# EAGLE schematic Schematic (EAGLE 9.7.0)
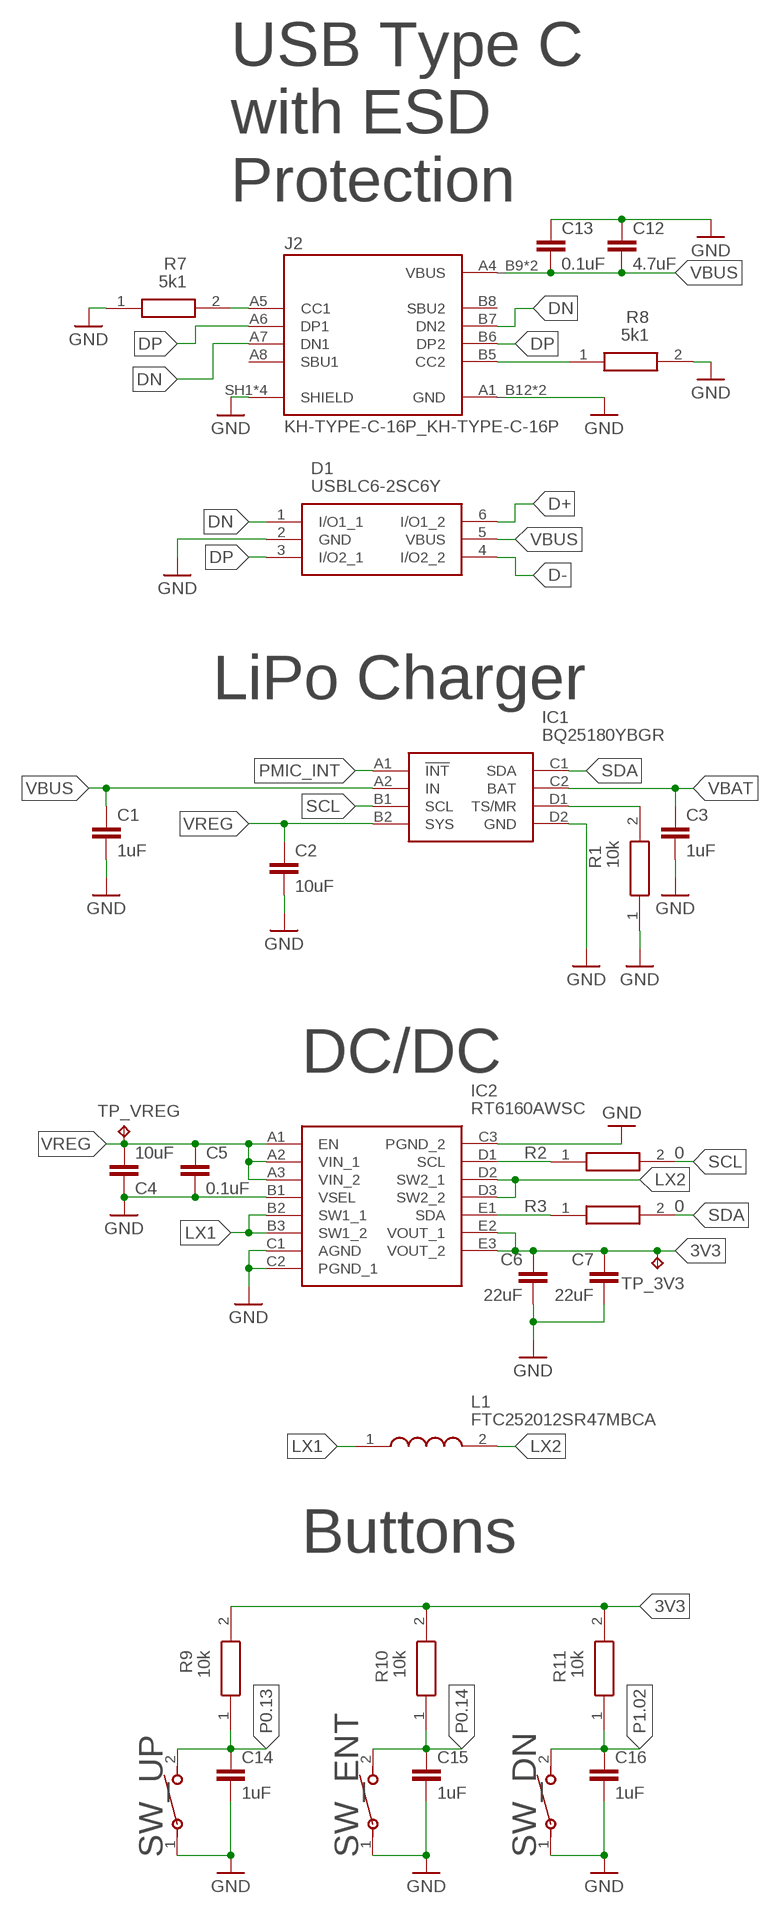
[diagram p0: schematic, sheet 1, part 1 of 2]
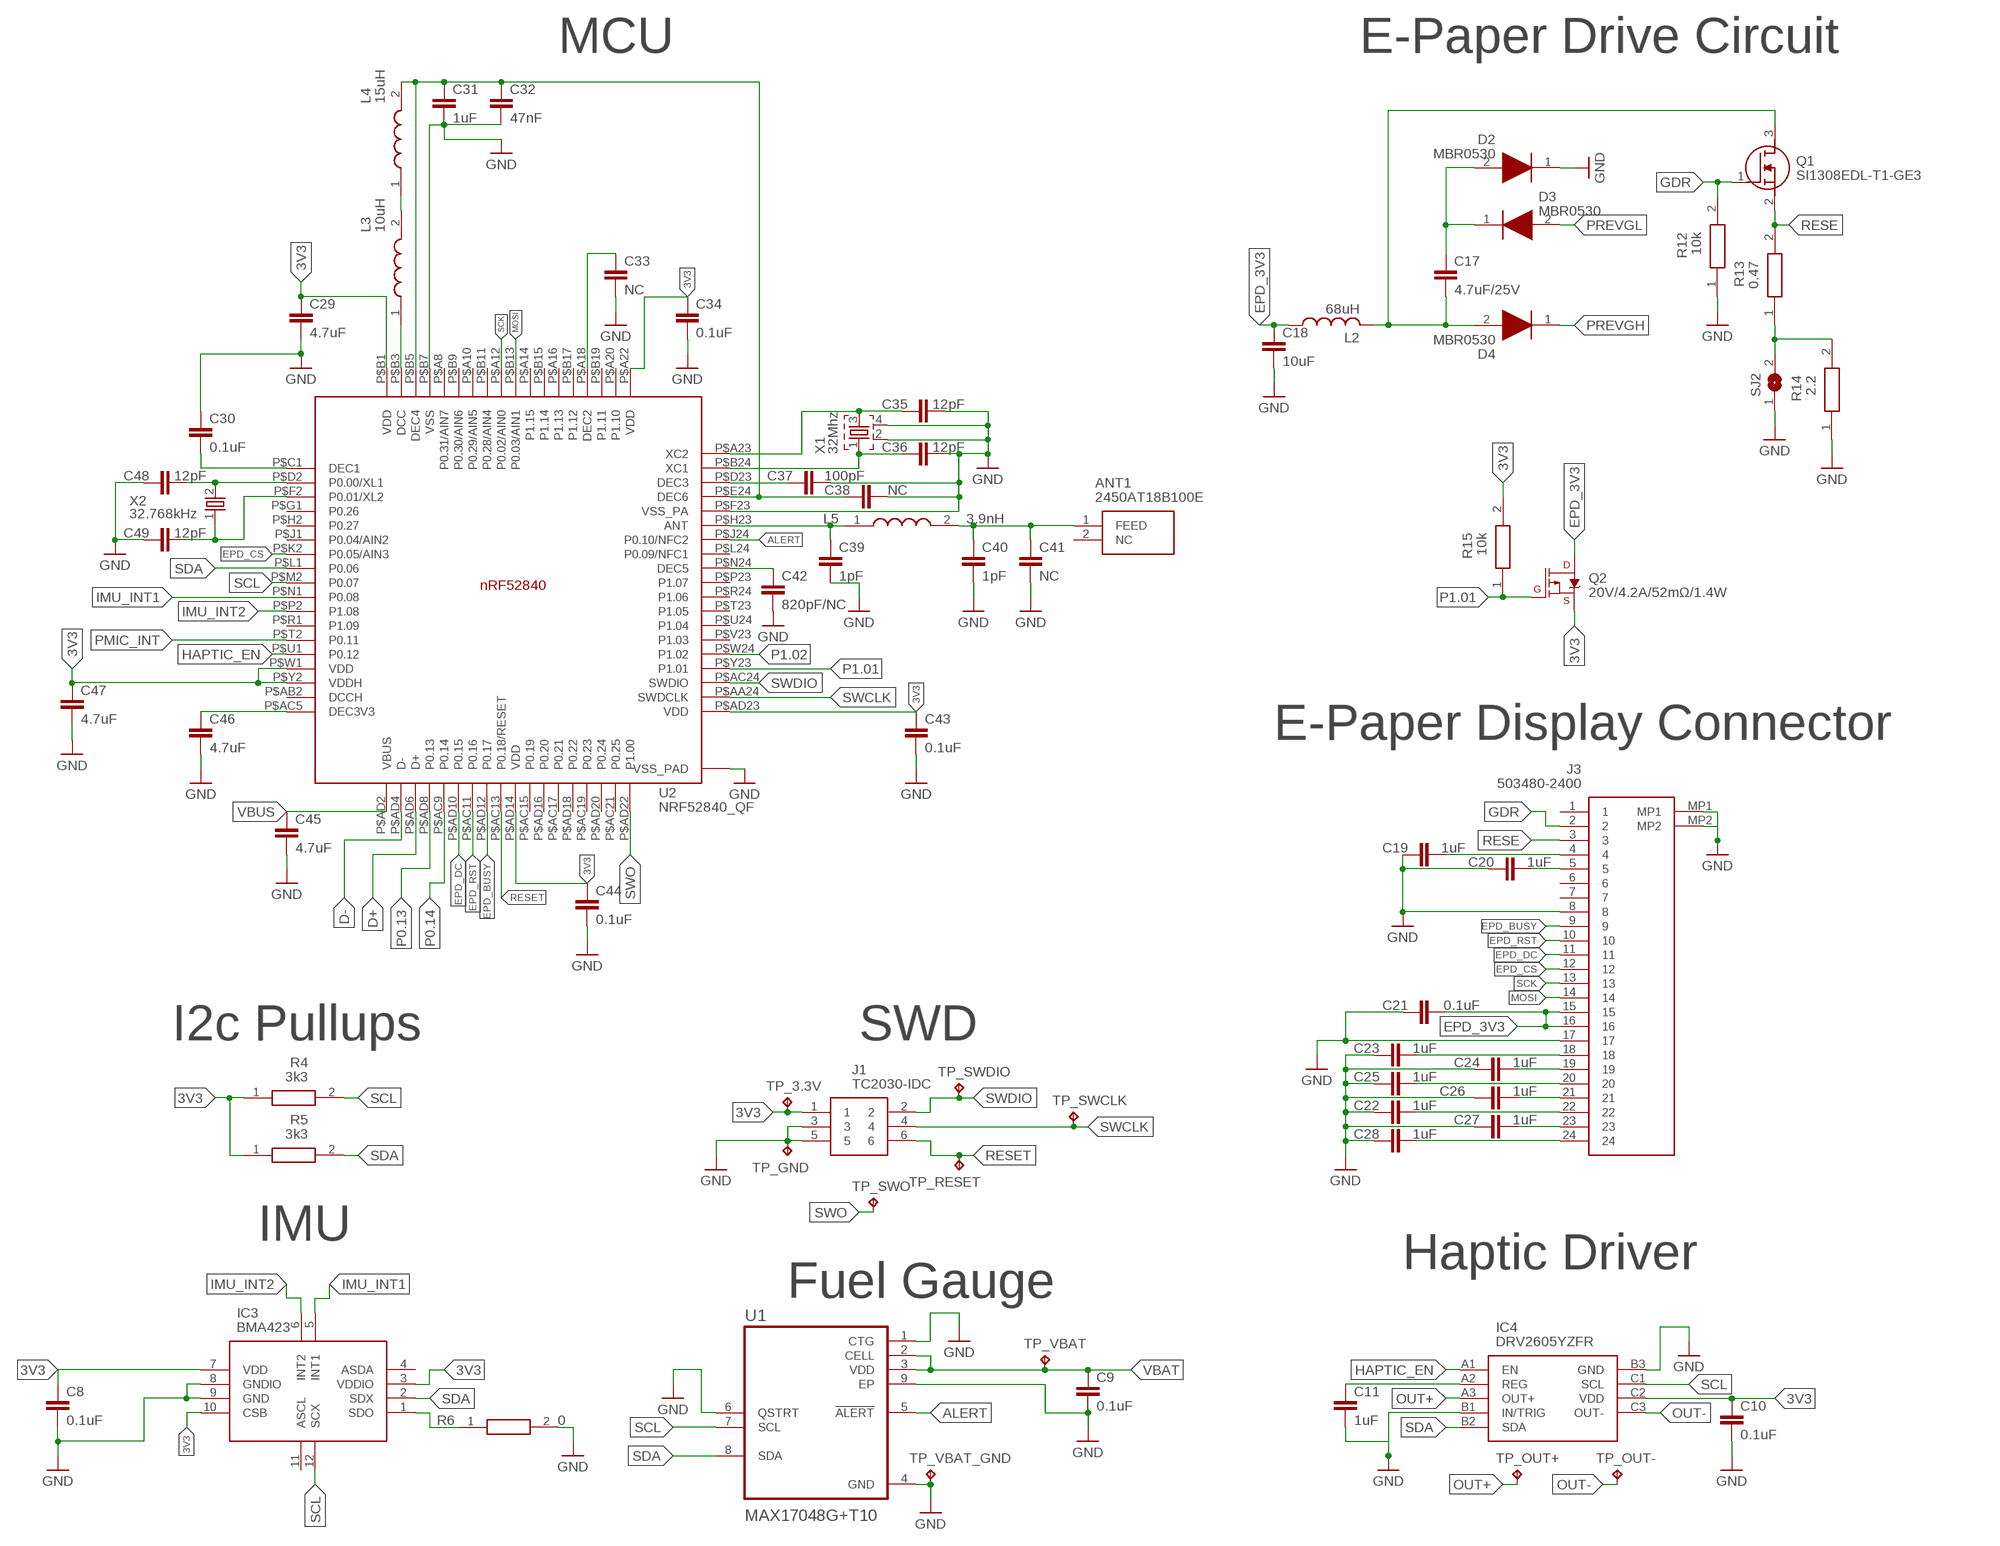
[diagram p1: schematic, sheet 1, part 2 of 2]

## Parts
ANT1  2450AT18B100E  2450AT18B100E_2450AT18B100E  [2450AT18B100E_ANTC3216X140N]
C1  1uF  NORDIC_NRF_3_CAPACITOR_0402_N  [NORDIC_NRF_3_RESC0402_N]
C2  10uF  NORDIC_NRF_3_CAPACITOR_0402_N  [NORDIC_NRF_3_RESC0402_N]
C3  1uF  NORDIC_NRF_3_CAPACITOR_0402_N  [NORDIC_NRF_3_RESC0402_N]
C4  10uF  NORDIC_NRF_3_CAPACITOR_0402_N  [NORDIC_NRF_3_RESC0402_N]
C5  0.1uF  NORDIC_NRF_3_CAPACITOR_0201_N  [NORDIC_NRF_3_RESC0201_N]
C6  22uF  NORDIC_NRF_3_CAPACITOR_0402_N  [NORDIC_NRF_3_RESC0402_N]
C7  22uF  NORDIC_NRF_3_CAPACITOR_0402_N  [NORDIC_NRF_3_RESC0402_N]
C8  0.1uF  NORDIC_NRF_3_CAPACITOR_0201_N  [NORDIC_NRF_3_RESC0201_N]
C9  0.1uF  NORDIC_NRF_3_CAPACITOR_0201_N  [NORDIC_NRF_3_RESC0201_N]
C10  0.1uF  NORDIC_NRF_3_CAPACITOR_0201_N  [NORDIC_NRF_3_RESC0201_N]
C11  1uF  NORDIC_NRF_3_CAPACITOR_0402_N  [NORDIC_NRF_3_RESC0402_N]
C12  4.7uF  NORDIC_NRF_3_CAPACITOR_0402_N  [NORDIC_NRF_3_RESC0402_N]
C13  0.1uF  NORDIC_NRF_3_CAPACITOR_0201_N  [NORDIC_NRF_3_RESC0201_N]
C14  1uF  NORDIC_NRF_3_CAPACITOR_0402_N  [NORDIC_NRF_3_RESC0402_N]
C15  1uF  NORDIC_NRF_3_CAPACITOR_0402_N  [NORDIC_NRF_3_RESC0402_N]
C16  1uF  NORDIC_NRF_3_CAPACITOR_0402_N  [NORDIC_NRF_3_RESC0402_N]
C17  4.7uF/25V  NORDIC_NRF_3_CAPACITOR_0402_N  [NORDIC_NRF_3_RESC0402_N]
C18  10uF  NORDIC_NRF_3_CAPACITOR_0402_N  [NORDIC_NRF_3_RESC0402_N]
C19  1uF  NORDIC_NRF_3_CAPACITOR_0402_N  [NORDIC_NRF_3_RESC0402_N]
C20  1uF  NORDIC_NRF_3_CAPACITOR_0402_N  [NORDIC_NRF_3_RESC0402_N]
C21  0.1uF  NORDIC_NRF_3_CAPACITOR_0201_N  [NORDIC_NRF_3_RESC0201_N]
C22  1uF  NORDIC_NRF_3_CAPACITOR_0402_N  [NORDIC_NRF_3_RESC0402_N]
C23  1uF  NORDIC_NRF_3_CAPACITOR_0402_N  [NORDIC_NRF_3_RESC0402_N]
C24  1uF  NORDIC_NRF_3_CAPACITOR_0402_N  [NORDIC_NRF_3_RESC0402_N]
C25  1uF  NORDIC_NRF_3_CAPACITOR_0402_N  [NORDIC_NRF_3_RESC0402_N]
C26  1uF  NORDIC_NRF_3_CAPACITOR_0402_N  [NORDIC_NRF_3_RESC0402_N]
C27  1uF  NORDIC_NRF_3_CAPACITOR_0402_N  [NORDIC_NRF_3_RESC0402_N]
C28  1uF  NORDIC_NRF_3_CAPACITOR_0402_N  [NORDIC_NRF_3_RESC0402_N]
C29  4.7uF  NORDIC_NRF_3_CAPACITOR_0402_N  [NORDIC_NRF_3_RESC0402_N]
C30  0.1uF  NORDIC_NRF_3_CAPACITOR_0201_N  [NORDIC_NRF_3_RESC0201_N]
C31  1uF  NORDIC_NRF_3_CAPACITOR_0402_N  [NORDIC_NRF_3_RESC0402_N]
C32  47nF  NORDIC_NRF_3_CAPACITOR_0201_N  [NORDIC_NRF_3_RESC0201_N]
C33  NC  NORDIC_NRF_3_CAPACITOR_0201_N  [NORDIC_NRF_3_RESC0201_N]
C34  0.1uF  NORDIC_NRF_3_CAPACITOR_0201_N  [NORDIC_NRF_3_RESC0201_N]
C35  12pF  NORDIC_NRF_3_CAPACITOR_0201_N  [NORDIC_NRF_3_RESC0201_N]
C36  12pF  NORDIC_NRF_3_CAPACITOR_0201_N  [NORDIC_NRF_3_RESC0201_N]
C37  100pF  NORDIC_NRF_3_CAPACITOR_0201_N  [NORDIC_NRF_3_RESC0201_N]
C38  NC  NORDIC_NRF_3_CAPACITOR_0201_N  [NORDIC_NRF_3_RESC0201_N]
C39  1pF  NORDIC_NRF_3_CAPACITOR_0201_N  [NORDIC_NRF_3_RESC0201_N]
C40  1pF  NORDIC_NRF_3_CAPACITOR_0201_N  [NORDIC_NRF_3_RESC0201_N]
C41  NC  NORDIC_NRF_3_CAPACITOR_0201_N  [NORDIC_NRF_3_RESC0201_N]
C42  820pF/NC  NORDIC_NRF_3_CAPACITOR_0201_N  [NORDIC_NRF_3_RESC0201_N]
C43  0.1uF  NORDIC_NRF_3_CAPACITOR_0201_N  [NORDIC_NRF_3_RESC0201_N]
C44  0.1uF  NORDIC_NRF_3_CAPACITOR_0201_N  [NORDIC_NRF_3_RESC0201_N]
C45  4.7uF  NORDIC_NRF_3_CAPACITOR_0402_N  [NORDIC_NRF_3_RESC0402_N]
C46  4.7uF  NORDIC_NRF_3_CAPACITOR_0402_N  [NORDIC_NRF_3_RESC0402_N]
C47  4.7uF  NORDIC_NRF_3_CAPACITOR_0402_N  [NORDIC_NRF_3_RESC0402_N]
C48  12pF  NORDIC_NRF_3_CAPACITOR_0201_N  [NORDIC_NRF_3_RESC0201_N]
C49  12pF  NORDIC_NRF_3_CAPACITOR_0201_N  [NORDIC_NRF_3_RESC0201_N]
D1  USBLC6-2SC6Y  ESP32_C6_LIBRARY_3_USBLC6-2SC6Y  [ESP32_C6_LIBRARY_3_SOT95P280X145-6N]
D2  MBR0530  ESP32_C6_LIBRARY_5_MBR0530  [ESP32_C6_LIBRARY_5_SOD3716X135N]
D3  MBR0530  ESP32_C6_LIBRARY_5_MBR0530  [ESP32_C6_LIBRARY_5_SOD3716X135N]
D4  MBR0530  ESP32_C6_LIBRARY_5_MBR0530  [ESP32_C6_LIBRARY_5_SOD3716X135N]
IC1  BQ25180YBGR  BQ25180YBGR_BQ25180YBGR  [BQ25180YBGR_BGA8C40P2X4_100X155X50]
IC2  RT6160AWSC  RT6160AWSC_RT6160AWSC  [RT6160AWSC_BGA15C40P3X5_140X230X60]
IC3  BMA423  BMA423_BMA423  [BMA423_BMA423]
IC4  DRV2605YZFR  DRV2605YZFR_DRV2605YZFR  [DRV2605YZFR_BGA9C50P3X3_144X144X62]
J1  TC2030-IDC  TC2030-IDC_TC2030-IDC  [TC2030-IDC_TC2030IDC]
J2  KH-TYPE-C-16P_KH-TYPE-C-16P  [KH-TYPE-C-16P_KINGHELM_KH-TYPE-C-16P]
J3  503480-2400  503480-2400_503480-2400  [503480-2400_5034802400]
L1  FTC252012SR47MBCA  MLP2016SR47MT0S1_FTC252012SR47MBCA  [MLP2016SR47MT0S1_INDC2016X100N]
L2  68uH  NORDIC_NRF_2_INDUCTOR_0402_L  [NORDIC_NRF_2_RESC0402_L]
L3  10uH  MLP2016SR47MT0S1_FTC252012SR47MBCA  [MLP2016SR47MT0S1_INDC2016X100N]
L4  15uH  MLP2016SR47MT0S1_FTC252012SR47MBCA  [MLP2016SR47MT0S1_INDC2016X100N]
L5  3.9nH  MLP2016SR47MT0S1_FTC252012SR47MBCA  [MLP2016SR47MT0S1_INDC2016X100N]
Q1  SI1308EDL-T1-GE3  ESP32_C6_LIBRARY_6_SI1308EDL-T1-GE3  [ESP32_C6_LIBRARY_6_SOT65P210X110-3N]
Q2  20V/4.2A/52mΩ/1.4W  ESP32_C6_LIBRARY_4_ESP32_WROVER_SPARKFUN-DISCRETESEMI_MOSFET_PCH-DMG2305UX-7  [ESP32_C6_LIBRARY_4_ESP32_C6_LIBRARY_4_ESP32_C6_LIBRARY_4_ESP32_C6_LIBRARY_4_ESP32_WROVER_SPARKFUN-DISCRETESEMI_SOT23-3]
R1  10k  CPF0201D7K68C1_CPF0201D7K68C1  [CPF0201D7K68C1_0201]
R2  0  CPF0201D7K68C1_CPF0201D7K68C1  [CPF0201D7K68C1_0201]
R3  0  CPF0201D7K68C1_CPF0201D7K68C1  [CPF0201D7K68C1_0201]
R4  3k3  CPF0201D7K68C1_CPF0201D7K68C1  [CPF0201D7K68C1_0201]
R5  3k3  CPF0201D7K68C1_CPF0201D7K68C1  [CPF0201D7K68C1_0201]
R6  0  CPF0201D7K68C1_CPF0201D7K68C1  [CPF0201D7K68C1_0201]
R7  5k1  CPF0201D7K68C1_CPF0201D7K68C1  [CPF0201D7K68C1_0201]
R8  5k1  CPF0201D7K68C1_CPF0201D7K68C1  [CPF0201D7K68C1_0201]
R9  10k  CPF0201D7K68C1_CPF0201D7K68C1  [CPF0201D7K68C1_0201]
R10  10k  CPF0201D7K68C1_CPF0201D7K68C1  [CPF0201D7K68C1_0201]
R11  10k  CPF0201D7K68C1_CPF0201D7K68C1  [CPF0201D7K68C1_0201]
R12  10k  CPF0201D7K68C1_CPF0201D7K68C1  [CPF0201D7K68C1_0201]
R13  0.47  CPF0201D7K68C1_CPF0201D7K68C1  [CPF0201D7K68C1_0201]
R14  2.2  CPF0201D7K68C1_CPF0201D7K68C1  [CPF0201D7K68C1_0201]
R15  10k  CPF0201D7K68C1_CPF0201D7K68C1  [CPF0201D7K68C1_0201]
SJ2  ESP32_C6_LIBRARY_7_JUMPER_SJ  [ESP32_C6_LIBRARY_7_JUMPER_SJ]
SW_DN  2025-10-22_07-23-44_LIBRARY_EVP-AKE31ASW_EVP-AKE31A_PAN  [2025-10-22_07-23-44_LIBRARY_SW_EVP-AKE31A_PAN]
SW_ENT  2025-10-22_07-23-44_LIBRARY_EVP-AKE31ASW_EVP-AKE31A_PAN  [2025-10-22_07-23-44_LIBRARY_SW_EVP-AKE31A_PAN]
SW_UP  2025-10-22_07-23-44_LIBRARY_EVP-AKE31ASW_EVP-AKE31A_PAN  [2025-10-22_07-23-44_LIBRARY_SW_EVP-AKE31A_PAN]
TP_3.3V  HECTOR_WATCH_1_TPTP20R  [HECTOR_WATCH_1_TP20R]
TP_3V3  HECTOR_WATCH_1_TPTP20R  [HECTOR_WATCH_1_TP20R]
TP_GND  HECTOR_WATCH_1_TPTP20R  [HECTOR_WATCH_1_TP20R]
TP_OUT+  HECTOR_WATCH_1_TPTP20R  [HECTOR_WATCH_1_TP20R]
TP_OUT-  HECTOR_WATCH_1_TPTP20R  [HECTOR_WATCH_1_TP20R]
TP_RESET  HECTOR_WATCH_1_TPTP20R  [HECTOR_WATCH_1_TP20R]
TP_SWCLK  HECTOR_WATCH_1_TPTP20R  [HECTOR_WATCH_1_TP20R]
TP_SWDIO  HECTOR_WATCH_1_TPTP20R  [HECTOR_WATCH_1_TP20R]
TP_SWO  HECTOR_WATCH_1_TPTP20R  [HECTOR_WATCH_1_TP20R]
TP_VBAT  HECTOR_WATCH_1_TPTP20R  [HECTOR_WATCH_1_TP20R]
TP_VBAT_GND  HECTOR_WATCH_1_TPTP20R  [HECTOR_WATCH_1_TP20R]
TP_VREG  HECTOR_WATCH_1_TPTP20R  [HECTOR_WATCH_1_TP20R]
U1  MAX17048G+T10  ESP32_C6_LIBRARY_MAX17048G+T10  [ESP32_C6_LIBRARY_SON50P200X200X80-9N]
U2  NRF52840_QF  NORDIC_NRF_4_NRF52840_QF  [NORDIC_NRF_4_AQFN50P700X700X85_HS-74N]
X1  32Mhz  NORDIC_NRF_XTAL_32MHZ  [NORDIC_NRF_BT-XTAL_2016_N]
X2  32.768kHz  NORDIC_NRF_1_XTAL_32KHZ  [NORDIC_NRF_1_XTAL_3215_N]

## Nets
3V3: C6.1 C7.1 C8.1 C10.1 C29.1 C34.1 C43.1 C44.1 C47.1 IC2.E2(VOUT_1) IC2.E3(VOUT_2) IC3.3(VDDIO) IC3.7(VDD) IC3.10(CSB) IC4.C2(VDD) J1.1 Q2.2(S) R4.1 R5.1 R9.2 R10.2 R11.2 R15.2 TP_3.3V.TP TP_3V3.TP U2.P$A22(VDD) U2.P$AD14(VDD) U2.P$AD23(VDD) U2.P$B1(VDD) U2.P$W1(VDD) U2.P$Y2(VDDH)
ALERT: U1.5(!ALERT) U2.P$J24(P0.10/NFC2)
D+: D1.6(I/O1_2) U2.P$AD6(D+)
D-: D1.4(I/O2_2) U2.P$AD4(D-)
DN: D1.1(I/O1_1) J2.A7(DN1) J2.B7(DN2)
DP: D1.3(I/O2_1) J2.A6(DP1) J2.B6(DP2)
EPD_3V3: C18.1 C21.2 J3.15 J3.16 L2.1 Q2.3(D)
EPD_BUSY: J3.9 U2.P$AD12(P0.17)
EPD_CS: J3.12 U2.P$K2(P0.05/AIN3)
EPD_DC: J3.11 U2.P$AD10(P0.15)
EPD_RST: J3.10 U2.P$AC11(P0.16)
GDR: J3.2 Q1.1(G) R12.2
GND: C1.2 C2.2 C3.2 C4.1 C5.2 C6.2 C7.2 C8.2 C9.2 C10.2 C11.2 C12.1 C13.1 C14.2 C15.2 C16.2 C18.2 C19.1 C20.1 C21.1 C22.1 C23.1 C24.1 C25.1 C26.1 C27.1 C28.1 C29.2 C30.1 C31.2 C32.2 C33.2 C34.2 C35.2 C36.2 C37.2 C38.2 C39.2 C40.2 C41.2 C42.2 C43.2 C44.2 C45.2 C46.2 C47.2 C48.1 C49.1 D1.2(GND) D2.1(K) IC1.D2(GND) IC2.B1(VSEL) IC2.C1(AGND) IC2.C2(PGND_1) IC2.C3(PGND_2) IC3.8(GNDIO) IC3.9(GND) IC4.B1(IN/TRIG) IC4.B3(GND) J1.3 J1.5 J2.A1_B12(GND) J2.A12_B1(GND) J2.SH1(SHIELD) J2.SH2(SHIELD) J2.SH3(SHIELD) J2.SH4(SHIELD) J3.8 J3.17 J3.MP1 J3.MP2 R1.1 R6.2 R7.1 R8.2 R12.1 R14.1 SJ2.1 SW_DN.1 SW_ENT.1 SW_UP.1 TP_GND.TP TP_VBAT_GND.TP U1.1(CTG) U1.4(GND) U1.6(QSTRT) U1.9(EP) U2.P$74(VSS_PAD) U2.P$75(VSS_PAD) U2.P$76(VSS_PAD) U2.P$77(VSS_PAD) U2.P$78(VSS_PAD) U2.P$79(VSS_PAD) U2.P$80(VSS_PAD) U2.P$81(VSS_PAD) U2.P$82(VSS_PAD) U2.P$83(VSS_PAD) U2.P$84(VSS_PAD) U2.P$85(VSS_PAD) U2.P$86(VSS_PAD) U2.P$87(VSS_PAD) U2.P$88(VSS_PAD) U2.P$89(VSS_PAD) U2.P$90(VSS_PAD) U2.P$B7(VSS) U2.P$F23(VSS_PA) X1.2 X1.4
HAPTIC_EN: IC4.A1(EN) U2.P$U1(P0.12)
IMU_INT1: IC3.5(INT1) U2.P$N1(P0.08)
IMU_INT2: IC3.6(INT2) U2.P$P2(P1.08)
LX1: IC2.B2(SW1_1) IC2.B3(SW1_2) L1.1
LX2: IC2.D2(SW2_1) IC2.D3(SW2_2) L1.2
MOSI: J3.14 U2.P$B13(P0.03/AIN1)
N$1: IC1.D1(TS/MR) R1.2
N$5: IC2.D1(SCL) R2.1
N$8: IC2.E1(SDA) R3.1
N$20: IC3.1(SDO) R6.1
N$27: C11.1 IC4.A2(REG)
N$31: J2.A5(CC1) R7.2
N$37: C17.1 D2.2(A) D3.1(K)
N$38: J2.B5(CC2) R8.1
N$40: C17.2 D4.2(A) L2.2 Q1.3(D)
N$48: R13.1 R14.2 SJ2.2
N$50: C19.2 J3.4
N$51: C20.2 J3.5
N$54: C23.2 J3.18
N$55: C24.2 J3.19
N$56: C25.2 J3.20
N$57: C26.2 J3.21
N$58: C22.2 J3.22
N$59: C27.2 J3.23
N$60: C28.2 J3.24
N$63: C30.2 U2.P$C1(DEC1)
N$64: L3.1 U2.P$B3(DCC)
N$65: L3.2 L4.1
N$66: C31.1 C32.1 C38.1 L4.2 U2.P$B5(DEC4) U2.P$E24(DEC6)
N$71: C33.1 U2.P$A18(DEC2)
N$73: C36.1 U2.P$B24(XC1) X1.1
N$74: C35.1 U2.P$A23(XC2) X1.3
N$75: C37.1 U2.P$D23(DEC3)
N$77: C39.1 L5.1 U2.P$H23(ANT)
N$78: ANT1.1(FEED) C40.1 C41.1 L5.2
N$80: C42.1 U2.P$N24(DEC5)
N$94: C46.1 U2.P$AC5(DEC3V3)
N$103: C48.2 U2.P$D2(P0.00/XL1) X2.2
N$104: C49.2 U2.P$F2(P0.01/XL2) X2.1
OUT+: IC4.A3(OUT+) TP_OUT+.TP
OUT-: IC4.C3(OUT-) TP_OUT-.TP
P0.13: C14.1 R9.1 SW_UP.2 U2.P$AD8(P0.13)
P0.14: C15.1 R10.1 SW_ENT.2 U2.P$AC9(P0.14)
P1.01: Q2.1(G) R15.1 U2.P$Y23(P1.01)
P1.02: C16.1 R11.1 SW_DN.2 U2.P$W24(P1.02)
PMIC_INT: IC1.A1(!INT) U2.P$T2(P0.11)
PREVGH: D4.1(K)
PREVGL: D3.2(A)
RESE: J3.3 Q1.2(S) R13.2
RESET: J1.6 TP_RESET.TP U2.P$AC13(P0.18/RESET)
SCK: J3.13 U2.P$A12(P0.02/AIN0)
SCL: IC1.B1(SCL) IC3.12(SCX) IC4.C1(SCL) R2.2 R4.2 U1.7(SCL) U2.P$M2(P0.07)
SDA: IC1.C1(SDA) IC3.2(SDX) IC4.B2(SDA) R3.2 R5.2 U1.8(SDA) U2.P$L1(P0.06)
SWCLK: J1.4 TP_SWCLK.TP U2.P$AA24(SWDCLK)
SWDIO: J1.2 TP_SWDIO.TP U2.P$AC24(SWDIO)
SWO: TP_SWO.TP U2.P$AD22(P1.00)
VBAT: C9.1 IC1.C2(BAT) TP_VBAT.TP U1.2(CELL) U1.3(VDD)
VBUS: C1.1 C12.2 C13.2 C45.1 D1.5(VBUS) IC1.A2(IN) J2.A4_B9(VBUS) J2.A9_B4(VBUS) U2.P$AD2(VBUS)
VREG: C2.1 C4.2 C5.1 IC1.B2(SYS) IC2.A1(EN) IC2.A2(VIN_1) IC2.A3(VIN_2) TP_VREG.TP
VREG1: C3.1
Unconnected: ANT1.2(NC) IC3.4(ASDA) IC3.11(ASCL) J2.A8(SBU1) J2.B8(SBU2) J3.1 J3.6 J3.7 U2.P$A8(P0.31/AIN7) U2.P$A10(P0.29/AIN5) U2.P$A14(P1.15) U2.P$A16(P1.13) U2.P$A20(P1.10) U2.P$AB2(DCCH) U2.P$AC15(P0.19) U2.P$AC17(P0.21) U2.P$AC19(P0.23) U2.P$AC21(P0.25) U2.P$AD16(P0.20) U2.P$AD18(P0.22) U2.P$AD20(P0.24) U2.P$B9(P0.30/AIN6) U2.P$B11(P0.28/AIN4) U2.P$B15(P1.14) U2.P$B17(P1.12) U2.P$B19(P1.11) U2.P$G1(P0.26) U2.P$H2(P0.27) U2.P$J1(P0.04/AIN2) U2.P$L24(P0.09/NFC1) U2.P$P23(P1.07) U2.P$R1(P1.09) U2.P$R24(P1.06) U2.P$T23(P1.05) U2.P$U24(P1.04) U2.P$V23(P1.03)

## Notes on the sheet
- MCU | E-Paper Drive Circuit
- USB Type C
  with ESD
  Protection
- LiPo Charger
- E-Paper Display Connector
- DC/DC
- I2c Pullups | SWD
- IMU
- Buttons | Haptic Driver
- Fuel Gauge

## Library data of the parts
ANT1 = InkTime_v5:2450AT18B100E_2450AT18B100E: Antennas 2.45GHz ANTENNA Source: Datasheet <https://www.johansontechnology.com/datasheets/2450AT18B100/2450AT18B100.pdf>
C1-C49 = InkTime_v5:NORDIC_NRF_3_CAPACITOR: Generic chip capacitor
D1 = InkTime_v5:ESP32_C6_LIBRARY_3_USBLC6-2SC6Y: Low Cap. ESD Protection Auto SOT-23-6 STMicroelectronics USBLC6-2SC6Y, Dual Uni-Directional TVS Diode Array, 6-Pin SOT-23 Source: Datasheet <https://componentsearchengine.com/Datasheets/1/USBLC6-2SC6Y.pdf> Check availability <https://pricing.snapeda.com/parts/USBLC6-2SC6Y/STMicroelectronics/view-part?ref=eda>
D2-D4 = InkTime_v5:ESP32_C6_LIBRARY_5_MBR0530: ON SEMICONDUCTOR - MBR0530 - DIODE, SCHOTTKY, 0.5A, 30V, SOD-123 Source: Datasheet <http://www.onsemi.com/pub/Collateral/MBR0530T1-D.PDF> Check availability <https://pricing.snapeda.com/parts/MBR0530/ON%20Semiconductor/view-part?ref=eda>
IC1 = InkTime_v5:BQ25180YBGR_BQ25180YBGR: Charger IC Lithium Ion/Polymer, Lithium Iron Phosphate 8-DSBGA (1.6x1.1) Source: Datasheet <https://www.ti.com/lit/ds/symlink/bq25180.pdf?ts=1650264094470&ref_url=https%3A%2F%2Fwww.ti.com%2Fproduct%2FBQ25180>
IC2 = InkTime_v5:RT6160AWSC_RT6160AWSC: Buck-Boost Regulator Positive Output Step-Up/Step-Down I2C DC-DC Controller IC 15-WL-CSP (BSC) (1.4x2.3) Source: Datasheet <https://www.richtek.com/SaveDownload.aspx?specid=RT6160A>
IC3 = InkTime_v5:BMA423_BMA423: Accelerometers Triaxial low-g 12bit Acceleration Sensor Source: Datasheet <https://www.mouser.com/datasheet/2/783/BST-BMA423-DS000-1509600.pdf>
IC4 = InkTime_v5:DRV2605YZFR_DRV2605YZFR: Haptic Driver for ERM/LRA with Built-In Library and Smart Loop Architecture Source: Datasheet <http://www.ti.com/lit/gpn/drv2605>
J1 = InkTime_v5:TC2030-IDC_TC2030-IDC: CABLE ADAPTER 6 POS Source: Datasheet <https://datasheet.datasheetarchive.com/originals/distributors/Datasheets_SAMA/62bc384e093448baaaa63dbd0b9d8707.pdf>
J2 = InkTime_v5:KH-TYPE-C-16P_KH-TYPE-C-16P: Check availability <https://pricing.snapeda.com/parts/KH-TYPE-C-16P/kinghelm/view-part?ref=eda>
J3 = InkTime_v5:503480-2400_503480-2400: FFC & FPC Connectors 0.5mm FPC RA SMT Dual Contact 24Ckt Source: Datasheet <https://componentsearchengine.com/Datasheets/1/503480-2400.pdf>
L1 L3-L5 = InkTime_v5:MLP2016SR47MT0S1_FTC252012SR47MBCA: SMD / SMT Inductors (Coils), L=0.47?H, L x W x T : Source: Datasheet <https://product.tdk.com/system/files/dam/doc/product/inductor/inductor/smd/catalog/inductor_commercial_power_mlp2016_en.pdf>
L2 = InkTime_v5:NORDIC_NRF_2_INDUCTOR: Generic chip inductor
Q1 = InkTime_v5:ESP32_C6_LIBRARY_6_SI1308EDL-T1-GE3: MOSFET N-Ch 30V 1.5A TrenchFET SC70 Vishay Si1308EDL-T1-GE3 N-channel MOSFET Transistor, 1.5 A, 30 V, 3-Pin SC-70 Source: Datasheet <https://componentsearchengine.com/Datasheets/1/SI1308EDL-T1-GE3.pdf> Check availability <https://pricing.snapeda.com/parts/SI1308EDL-T1-GE3/Vishay%20Siliconix/view-part?ref=eda>
Q2 = InkTime_v5:ESP32_C6_LIBRARY_4_ESP32_WROVER_SPARKFUN-DISCRETESEMI_MOSFET_PCH: P-channel MOSFETs Voltage controlled devices that allow control of high current outputs. SparkFun Products: SparkFun ESP32 Thing <https://www.sparkfun.com/products/13907> SparkFun ESP8266 Thing <https://www.sparkfun.com/products/13231> SparkFun Pi Servo HAT V2 <https://www.sparkfun.com/products/15316> DMG2305UX-7 (20V/4.2A/SOT23-3)
R1-R15 = InkTime_v5:CPF0201D7K68C1_CPF0201D7K68C1: 7.68k 0201 Thin Film Surface Mount Fixed Resistor +/-0.5% 0.031W CPF0201D7K68C1 Source: Datasheet <http://www.te.com/commerce/DocumentDelivery/DDEController?Action=showdoc&DocId=Data Sheet1773200-1ApdfEnglishENG_DS_1773200-1_A.pdf4-2176215-6>
SJ2 = InkTime_v5:ESP32_C6_LIBRARY_7_JUMPER_SJ: SMD solder JUMPER
SW_DN SW_ENT SW_UP = InkTime_v5:2025-10-22_07-23-44_LIBRARY_EVP-AKE31A
TP_3.3V TP_3V3 TP_GND TP_OUT+ TP_OUT- TP_RESET TP_SWCLK TP_SWDIO TP_SWO TP_VBAT TP_VBAT_GND TP_VREG = InkTime_v5:HECTOR_WATCH_1_TP: Test pad
U1 = InkTime_v5:ESP32_C6_LIBRARY_MAX17048G+T10: Check availability <https://pricing.snapeda.com/parts/MAX17048G%2BT10/Analog%20Devices/view-part?ref=eda>
U2 = InkTime_v5:NORDIC_NRF_4_NRF52840_QF: nRF52840 Features Advanced Single chip 2.4 GHz multi-protocol SoC 32-bit ARM Cortex-M4F Processor 1.7v to 5.5v operation 1MB flash + 256kB RAM Bluetooth 5 support for long range and high throughput 802.15.4 radio support On-chip NFC PPI –Programmable Peripheral Interconnect Automated power management system with automatic power management of each peripheral Configurable I/O mapping for analog and digital I/O 48 x GPIO 1 x QSPI 4 x Master/Slave SPI 2 x Two-wire interface (I²C) I²S interface 2 x UART 4 x PWM USB 2.0 controller ARM TrustZone CryptoCell-310 Cryptographic and security module AES 128-bit ECB/CCM/AAR hardware accelerator Digital microphone interface (PDM) Quadrature decoder 12-bit ADC Low power comparator On-chip 50Ω balun On-air compatible with nRF52, nRF51 and nRF24 Series Applications Advanced high performance wearables Wearables for secure payments Virtual Reality/Augmented Reality systems Smart Home sensor networks Smart city sensor networks High performance HID controllers Internet of Things (IoT) sensor networks Smart door locks Smart lighting networks Connected white goods
X1 = InkTime_v5:NORDIC_NRF_XTAL_32MHZ
X2 = InkTime_v5:NORDIC_NRF_1_XTAL_32KHZ